# Altium schematic sheet POWER.SchDoc
size A4
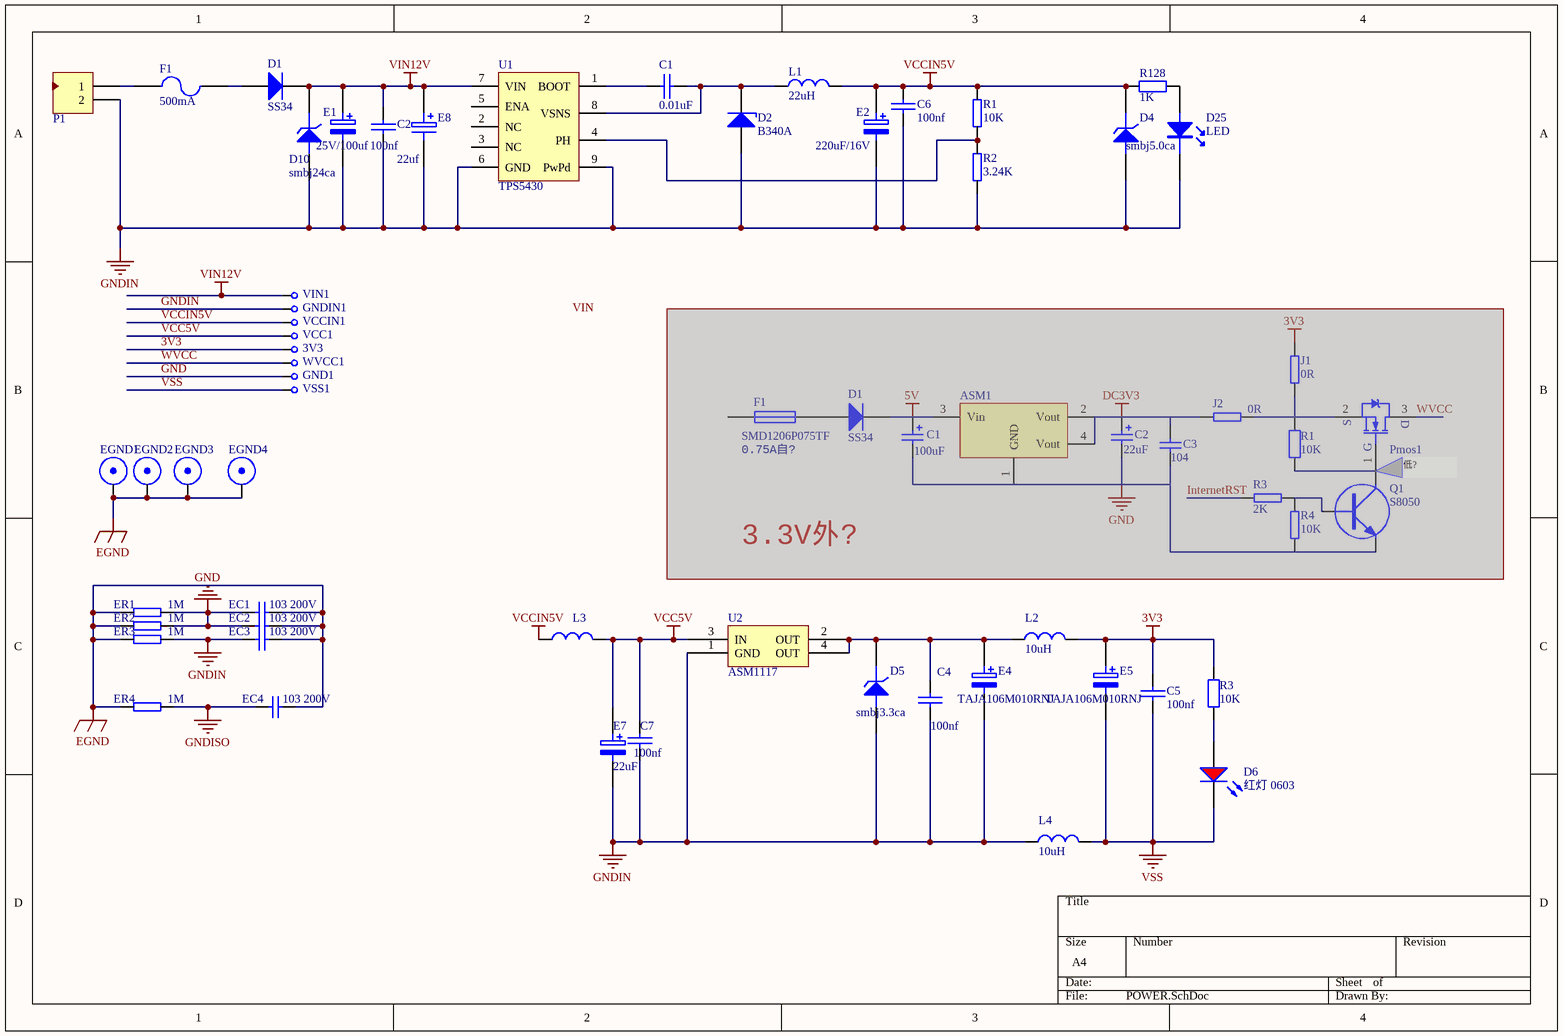
[diagram p0: POWER.SchDoc]

## Parts
(Parts that share a designator on the sheet are numbered #1, #2 ... from top to bottom, then left to right.)
3V3  CHECK  [CHECK-B]  (value not drawn)
ASM1  ASM1117-3.3  [LC-SOT-223]  (value not drawn)  (masked out: inside a compile mask, not in the netlist)
C1#1  0.01uF  [LC-0603_C]
C1#2  100uF  [HONOR_63X54]  (masked out: inside a compile mask, not in the netlist)
C2#1  100nf  [LC-0603_C]
C2#2  22uF  [HONOR_63X54]  (masked out: inside a compile mask, not in the netlist)
C3  104  [LC-0603_C]  (masked out: inside a compile mask, not in the netlist)
C4  100nf  [LC-0603_C]
C5  100nf  [LC-0603_C]
C6  100nf  [LC-0603_C]
C7  100nf  [LC-0603_C]
D1#1  SS34  [LC-SMA(DO-214AC)_S1]
D1#2  SS34  [LC-SMA(DO-214AC)_S5]  (masked out: inside a compile mask, not in the netlist)
D2  value B340A  [LC-SMA(DO-214AC)_S1]  (hidden comment: Diode-Z)
D4  smbj5.0ca  [LC-SMB(DO-214AA)_S1]
D5  smbj3.3ca  [LC-SMB(DO-214AA)_S1]
D6  红灯 0603  [LC-0603_LED_S1]
D10  smbj24ca  [LC-SMB(DO-214AA)_S1]
D25  LED  [LC-0603_LED_S1]
E1  25V/100uf  [C-RB-SD8]
E2  220uF/16V  [C-RB-SD6]
E4  TAJA106M010RNJ  [LC-CASE-A_3216]
E5  TAJA106M010RNJ  [LC-CASE-A_3216]
E7  22uF  [LC-CASE-B_3528]
E8  22uf  [LC-CASE-B_3528]
EC1  103 200V  [LC-1206_C]
EC2  103 200V  [LC-1206_C]
EC3  103 200V  [LC-1206_C]
EC4  103 200V  [LC-1206_C]
EGND1  EGND  [H-6-3.2m]  (value not drawn)
EGND2  EGND  [H-6-3.2m]  (value not drawn)
EGND3  EGND  [H-6-3.2m]  (value not drawn)
EGND4  EGND  [H-6-3.2m]  (value not drawn)
ER1  1M  [LC-1206_R]
ER2  1M  [LC-1206_R]
ER3  1M  [LC-1206_R]
ER4  1M  [LC-1206_R]
F1#1  value 500mA  [1812]  (hidden comment: Fuse2)
F1#2  SMD1206P075TF  [LC-1206_R]  (masked out: inside a compile mask, not in the netlist)
GND1  CHECK  [CHECK-B]  (value not drawn)
GNDIN1  CHECK  [CHECK-B]  (value not drawn)
J1  0R  [LC-0603_L]  (masked out: inside a compile mask, not in the netlist)
J2  0R  [LC-0603_L]  (masked out: inside a compile mask, not in the netlist)
L1  value 22uH  [L-SMD-7]  (hidden comment: Inductor)
L2  value 10uH  [LC-0805_L]  (hidden comment: Inductor)
L3  22uh  [L-SMD-3012]  (value not drawn)
L4  value 10uH  [LC-0805_L]  (hidden comment: Inductor)
P1  Header 2  [D5.08-2P]  (value not drawn)
Pmos1  SI2301  [LC-SOT-23(SOT-23-3)]  (value not drawn)  (masked out: inside a compile mask, not in the netlist)
Q1  S8050  [LC-SOT-23(SOT-23-3)]  (masked out: inside a compile mask, not in the netlist)
R1#1  10K  [LC-0603_R]
R1#2  10K  [LC-0603_R]  (masked out: inside a compile mask, not in the netlist)
R2  3.24K  [LC-0603_R]
R3#1  2K  [LC-0603_R]  (masked out: inside a compile mask, not in the netlist)
R3#2  10K  [LC-0603_R]
R4  10K  [LC-0603_R]  (masked out: inside a compile mask, not in the netlist)
R128  1K  [LC-0603_R]
U1  TPS5430  [TPS5430]
U2  ASM1117  [SOT223]
VCC1  CHECK  [CHECK-B]  (value not drawn)
VCCIN1  CHECK  [CHECK-B]  (value not drawn)
VIN1  CHECK  [CHECK-B]  (value not drawn)
VSS1  CHECK  [CHECK-B]  (value not drawn)
WVCC1  CHECK  [CHECK-B]  (value not drawn)

## Nets
3V3: 3V3.1 C5.2 E5.1 L2.2 R3#2.1
EGND: EC1.1 EC2.1 EC3.1 EC4.1 EGND1.0 EGND2.0 EGND3.0 EGND4.0 ER1.1 ER2.1 ER3.1 ER4.1
GND: EC1.2 EC2.2 ER1.2 ER2.2 GND1.1
GNDIN: C2#1.1 C4.1 C6.1 C7.1 D2.1(A) D4.1(A) D5.1(A) D10.1(A) D25.K E1.2 E2.2 E4.2 E7.2 E8.2 EC3.2 ER3.2 GNDIN1.1 L4.1 P1.2 R2.2 U1.6(GND) U1.9(PwPd) U2.1(GND)
GNDISO: EC4.2 ER4.2
VCC5V: C7.2 E7.1 L3.2 U2.3(IN) VCC1.1
VCCIN5V: C6.2 D4.2(K) E2.1 L1.2 L3.1 R1#1.2 R128.1 VCCIN1.1
VIN12V: C2#1.2 D1#1.2(K) D10.2(K) E1.1 E8.1 U1.7(VIN) VIN1.1
VSS: C5.1 D6.K E5.2 L4.2 VSS1.1
WVCC: WVCC1.1
NetC1#1_1: C1#1.1 D2.2(K) L1.1 U1.8(VSNS)
NetC1#1_2: C1#1.2 U1.1(BOOT)
NetC4_2: C4.2 D5.2(K) E4.1 L2.1 U2.2(OUT) U2.4(OUT)
NetD1#1_1: D1#1.1(A) F1#1.2
NetD6_A: D6.A R3#2.2
NetD25_A: D25.A R128.2
NetF1#1_1: F1#1.1 P1.1
NetR1#1_1: R1#1.1 R2.1 U1.4(PH)

Not connected (* = marked no-connect by the designer): U1 2(NC) 3(NC) 5(ENA)

## Notes on the sheet
- (near F1#2) 0.75A自?
- 低?
- 3.3V外?
- Labels drawn without touching a wire or pin: VIN

## Library data of the parts
3V3 = CHE: 测试点
ASM1 = VOLTREG1
C1#1 C2#1 C4-C7 = CAP: Capacitor
C1#2 C2#2 = Cap Pol1: Polarized Capacitor (Radial); Published: 8-Jun-2000; Revision: July-2002: Re-released for DXP Platform.; Publisher: Altium Limited
  C1#2: Value: 100uF
  C2#2: Value: 22uF
C3 = Cap: Capacitor; Value: 100nF; Published: 8-Jun-2000; Revision: July-2002: Re-released for DXP Platform.; Publisher: Altium Limited
D1#1 = D: 二极管; Published: 8-Jun-2000; LatestRevisionDate: 17-Jul-2002; LatestRevisionNote: Re-released for DXP Platform.; PackageDocument: Sep-1996; PackageReference: SMC; Publisher: Altium Limited; Code_JEDEC: DO-214-AB
D1#2 = Diode: Default Diode; Published: 8-Jun-2000; LatestRevisionDate: 17-Jul-2002; LatestRevisionNote: Re-released for DXP Platform.; PackageDocument: Sep-1996; PackageReference: SMC; Publisher: Altium Limited; Code_JEDEC: DO-214-AB
D2 = Dio: 稳压二极管; Published: 8-Jun-2000; LatestRevisionDate: 17-Jul-2002; LatestRevisionNote: Re-released for DXP Platform.; PackageReference: SMB; Publisher: Altium Limited; Code_JEDEC: DO-214-AA
D4 D5 D10 = ZENER3: Zener Diode
D6 = 0603 红灯: 发光二极管; ComponentLink1Des: 供应商链接; ComponentLink1URL: http://www.szlcsc.com/product/details_2659.html; Package: 0603; Supplier: LC; SuppliersPartNumber: C2286
E1 E2 E4 E5 E7 = ELECTRO2: Electrolytic Capacitor
E8 = ELECTRO1: Electrolytic Capacitor
EC1-EC4 = Cap: Capacitor; Value: 103; Published: 8-Jun-2000; Revision: July-2002: Re-released for DXP Platform.; Publisher: Altium Limited
ER1-ER4 R1#1 R2 = RES2
F1#1 = Fuse2: 可恢复保险丝; Published: 8-Jun-2000; LatestRevisionDate: 17-Jul-2002; LatestRevisionNote: Re-released for DXP Platform.; PackageReference: PIN-W2/E2.8; Publisher: Altium Limited
F1#2 = Fuse 1: Fuse; Published: 8-Jun-2000; LatestRevisionDate: 17-Jul-2002; LatestRevisionNote: Re-released for DXP Platform.; PackageReference: PIN-W2/E2.8; Publisher: Altium Limited
GND1 GNDIN1 VCC1 VCCIN1 VIN1 VSS1 WVCC1 = C: 测试点
J1 J2 R3#1 R4 = RES
L1 L2 L4 = Ind: 电感; Code_IEC: 1005; Published: 8-Jun-2000; LatestRevisionDate: 17-Jul-2002; LatestRevisionNote: Re-released for DXP Platform.; PackageReference: 0402-A; Publisher: Altium Limited; Code_JEITA: 0402
L3 = Ind: 电感; Code_IEC: 1005; Value: 10uH; Published: 8-Jun-2000; LatestRevisionDate: 17-Jul-2002; LatestRevisionNote: Re-released for DXP Platform.; PackageReference: 0402-A; Publisher: Altium Limited; Code_JEITA: 0402
P1 = Header 2: 接插件; LatestRevisionDate: 17-Jul-2002; LatestRevisionNote: Re-released for DXP Platform.; Publisher: Altium Limited
Pmos1 = N-MOS
Q1 = NPN
R1#2 R128 = Res2: Resistor; Published: 8-Jun-2000; LatestRevisionDate: 17-Jul-2002; LatestRevisionNote: Re-released for DXP Platform.; PackageReference: AXIAL-0.4; Publisher: Altium Limited
  R1#2: Value: 10K
  R128: Value: 1K
R3#2 = Res2: Resistor; Value: 1K; Published: 8-Jun-2000; LatestRevisionDate: 17-Jul-2002; LatestRevisionNote: Re-released for DXP Platform.; PackageReference: AXIAL-0.4; Publisher: Altium Limited
U2 = ASM1: 3.3V稳压芯片